# EAGLE schematic configModule (EAGLE 9.6.2)
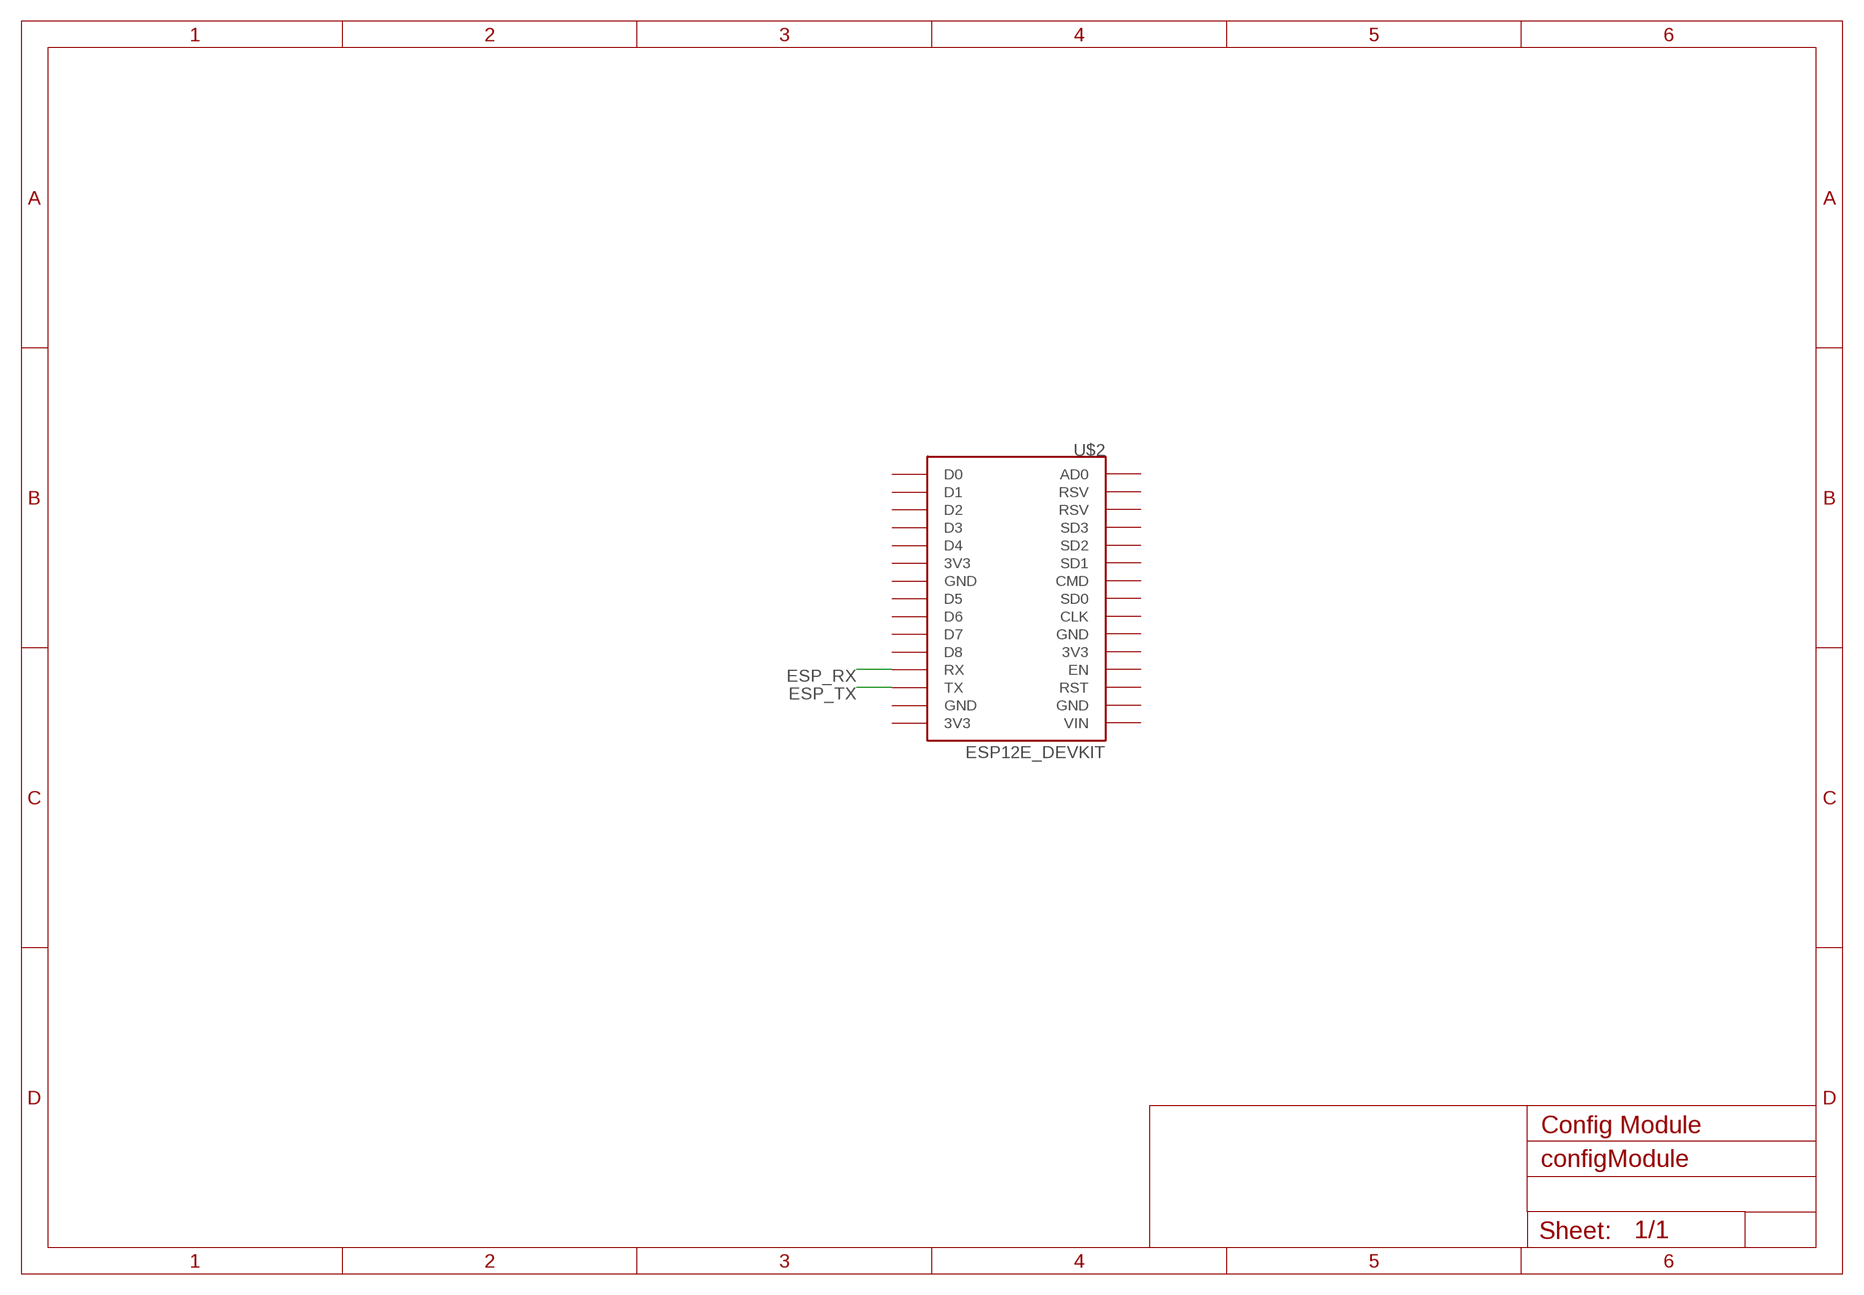
[diagram p0: schematic, sheet 1]

## Parts
U$2  ESP12E_DEVKIT  [ESP12E_DEVKIT]

## Nets
ESP_RX: U$2.RX
ESP_TX: U$2.TX
Unconnected: U$2.3V3@0(3V3) U$2.3V3@1(3V3) U$2.3V3@2(3V3) U$2.AD0 U$2.CLK U$2.CMD U$2.D0 U$2.D1 U$2.D2 U$2.D3 U$2.D4 U$2.D5 U$2.D6 U$2.D7 U$2.D8 U$2.EN U$2.GND@0(GND) U$2.GND@1(GND) U$2.GND@2(GND) U$2.GND@3(GND) U$2.RST U$2.RSV@0(RSV) U$2.RSV@1(RSV) U$2.SD0 U$2.SD1 U$2.SD2 U$2.SD3 U$2.VIN

## Notes on the sheet
- Config Module

## Library data of the parts
U$2 = ESP12E_DEVKIT:ESP12E_DEVKIT: ESP12E DEVKIT BOARD